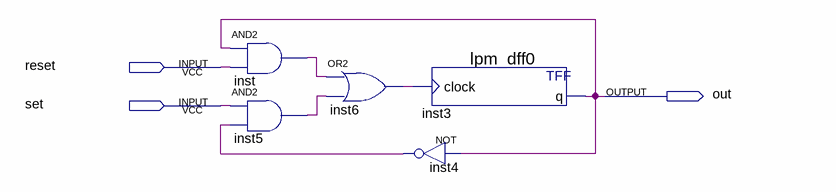
[diagram p0: schematic sheet]
// Quartus schematic RS-trigger.bdf as structural Verilog: 5 symbols, 3 pins
module \RS-trigger  (
  input  reset,
  input  set,
  output out
);

  wire inst4_out, inst5_out, inst6_out, inst_out;

  and inst (inst_out, out, reset);
  and inst5 (inst5_out, set, inst4_out);
  or inst6 (inst6_out, inst_out, inst5_out);
  not inst4 (inst4_out, out);
  lpm_dff0 inst3 (.clock(inst6_out), .q(out));
endmodule
